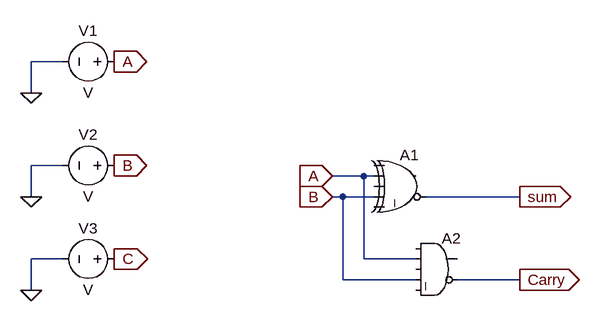
[diagram p0: schematic HalfAdder.asc]
HalfAdder.asc, the LTspice schematic file:
Version 4
SHEET 1 880 680
WIRE -384 -64 -432 -64
WIRE -432 -16 -432 -64
WIRE -384 96 -432 96
WIRE 80 112 32 112
WIRE 96 112 80 112
WIRE -432 144 -432 96
WIRE 48 144 32 144
WIRE 96 144 48 144
WIRE 320 144 176 144
WIRE -384 240 -432 240
WIRE 80 240 80 112
WIRE 160 240 80 240
WIRE 48 272 48 144
WIRE 160 272 48 272
WIRE 320 272 224 272
WIRE -432 288 -432 240
FLAG 32 112 A
IOPIN 32 112 In
FLAG 32 144 B
IOPIN 32 144 In
FLAG -304 -64 A
IOPIN -304 -64 Out
FLAG -304 96 B
IOPIN -304 96 Out
FLAG -304 240 C
IOPIN -304 240 Out
FLAG -432 -16 0
FLAG -432 144 0
FLAG -432 288 0
FLAG 320 144 sum
IOPIN 320 144 Out
FLAG 320 272 Carry
IOPIN 320 272 Out
SYMBOL Digital\\xor 144 64 R0
SYMATTR InstName A1
SYMBOL Digital\\and 192 192 R0
SYMATTR InstName A2
SYMBOL voltage -288 -64 R90
WINDOW 0 -32 56 VBottom 2
WINDOW 3 32 56 VTop 2
SYMATTR InstName V1
SYMBOL voltage -288 96 R90
WINDOW 0 -32 56 VBottom 2
WINDOW 3 32 56 VTop 2
SYMATTR InstName V2
SYMBOL voltage -288 240 R90
WINDOW 0 -32 56 VBottom 2
WINDOW 3 32 56 VTop 2
SYMATTR InstName V3

The netlist it stands for:
* HalfAdder.asc
A1 0 A 0 B 0 sum 0 0 XOR
A2 0 A 0 B 0 Carry 0 0 AND
V1 A 0 V
V2 B 0 V
V3 C 0 V
.backanno
.end